# EAGLE design Current Driver v1 (EAGLE 9.6.2)
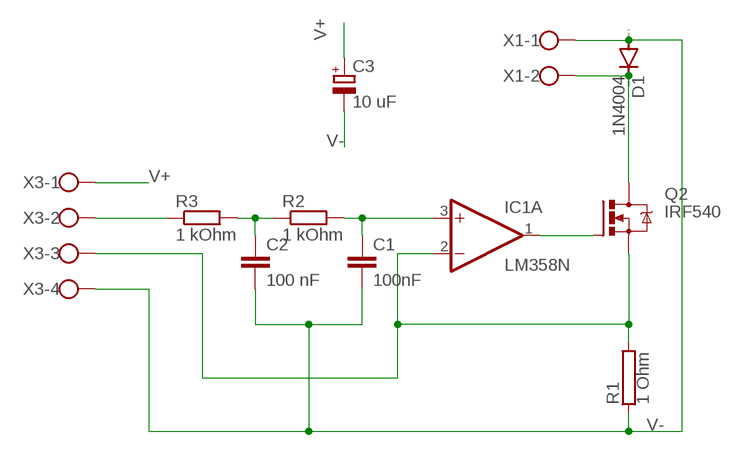
[diagram p0: schematic, sheet 1]

## Parts
C1  100nF  C-EU050-030X075  [C050-030X075]
C2  100 nF  C-EU050-030X075  [C050-030X075]
C3  10 uF  CPOL-EUE2,5-6E  [E2,5-6E]
D1  1N4004  [DO41-10]
IC1  LM358N  [DIL08]
Q2  IRF540  [TO220BV]
R1  1 Ohm  RAC05  [AC05]
R2  1 kOhm  R-EU_0204/7  [0204/7]
R3  1 kOhm  R-EU_0204/7  [0204/7]
X1  W237-102  [W237-102]
X3  W237-4  [W237-4]

## Nets
N$1: IC1.1(A:OUT) Q2.G
N$3: D1.C Q2.D X1.2
N$4: C2.1 R2.1 R3.2
N$5: C1.1 IC1.3(A:+IN) R2.2
N$6: R3.1 X3.2
N$7: IC1.2(A:-IN) Q2.S R1.2 X3.3
V+: C3.+ X3.1
V-: C1.2 C2.2 C3.- D1.A R1.1 X1.1 X3.4
Unconnected: IC1.5(B:+IN) IC1.6(B:-IN) IC1.7(B:OUT)

## Power pins joined to a net without a drawn wire
V+: IC1.8(P:V+)
V-: IC1.4(P:V-)

## Library data of the parts
C1 C2 = rcl:C-EU: CAPACITOR, European symbol; SPICEPREFIX: C
C3 = rcl:CPOL-EU: POLARIZED CAPACITOR, European symbol; SPICEPREFIX: C
D1 = diode:1N4004: DIODE general purpose rectifier, 1 A
IC1 = linear:LM358: OP AMP also LM158; LM258; LM2904 Source: http://cache.national.com/ds/LM/LM158.pdf
Q2 = transistor-power:IRF540: HEXFET Power MOSFET
R1 = resistor-power:R: Power Resitor; OC_FARNELL: unknown; OC_NEWARK: unknown
R2 R3 = rcl:R-EU_: RESISTOR, European symbol; SPICEPREFIX: R
X1 = con-wago-500:W237-102: WAGO SCREW CLAMP; MPN: 237-102; OC_FARNELL: unknown; OC_NEWARK: 70K9898
X3 = con-wago-500:W237-4: WAGO SCREW CLAMP; OC_FARNELL: unknown; OC_NEWARK: unknown

## Board
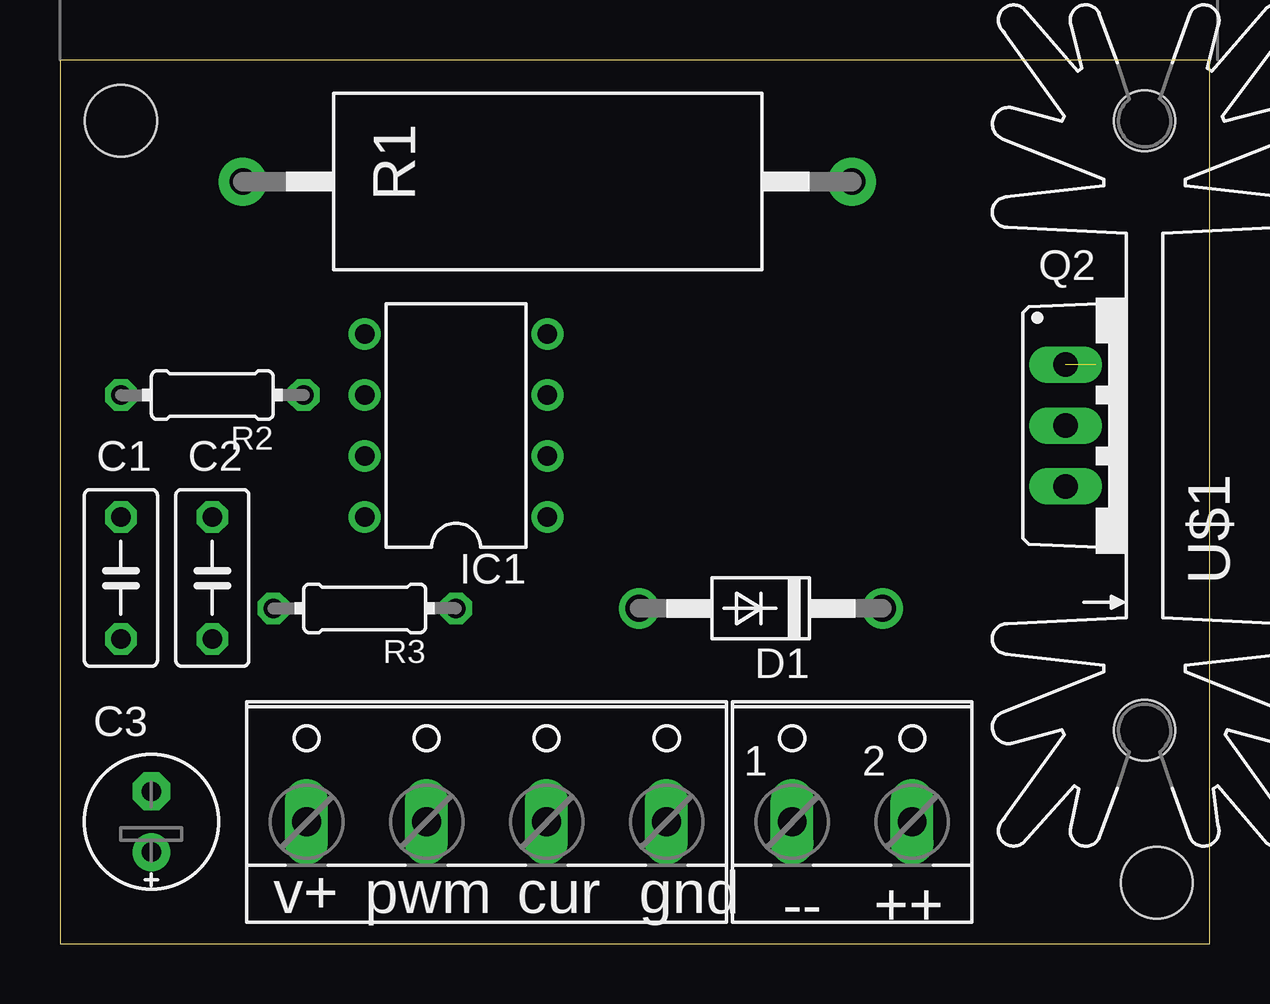
[diagram p1: board, top side]
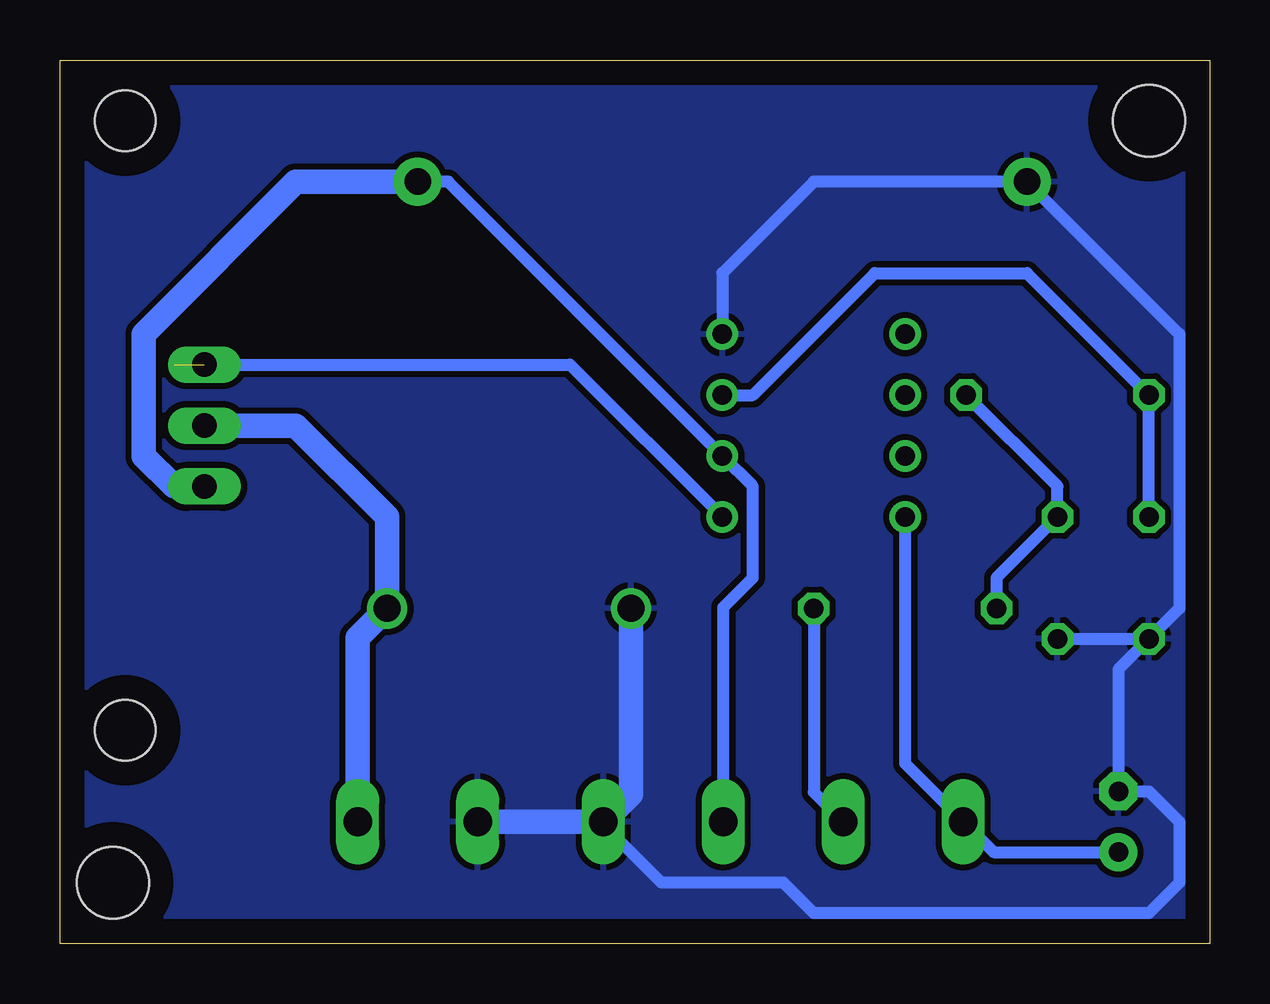
[diagram p2: board, bottom side, seen from below]

Size 47.93 x 36.82 mm. Coordinates in mm from the lower left corner, seen from the top.
Outline: 0,0 47.93,0 47.93,36.82 0,36.82 0,0
Copper layers (1*16): Top 0.035mm / dielectric 1.5mm / Bottom 0.035mm
Design rules "default *": minimum track width 10mil, minimum drill 0.35mm, track to track 10mil, track to pad 10mil, pad to pad 10mil, via to via 10mil, smd to smd 6mil, copper to edge 40mil, drill to drill 6mil, minimum pad ring 10mil, minimum via ring 8mil, stop-mask expansion 4mil, vias tented up to drill 0mil, thermal gap 10mil
Holes 3 mm at 2.54,34.29 45.72,2.54

### Footprints (pad centres in the part's own frame; a part is rotated, then mirrored left to right if it is on the bottom)
C050-030X075 = drill 0.813 octagon: 1 -2.54,0; 2 2.54,0
E2,5-6E = drill 0.813 pad 1.575: + -1.27,0 | drill 0.813 pad 1.575 octagon: - 1.27,0
DO41-10 = drill 1.118: A 5.08,0; C -5.08,0
DIL08 = drill 0.813 pad 1.27: 1 -3.81,-3.81; 2 -1.27,-3.81; 3 1.27,-3.81; 4 3.81,-3.81; 5 3.81,3.81; 6 1.27,3.81; 7 -1.27,3.81; 8 -3.81,3.81
TO220BV = drill 1.016 long: D 0,-2.54; G -2.54,-2.54; S 2.54,-2.54
AC05 = drill 1.1 pad 2: 1 -12.7,0; 2 12.7,0
0204/7 = drill 0.813 octagon: 1 -3.81,0; 2 3.81,0
SK104 = hole 2.54: -12.7,-0.762; 12.7,-0.762
W237-102 = drill 1.194 long: 1 -2.5,-1.27; 2 2.5,-1.27
W237-4 = drill 1.194 long: 1 -7.5,-1.27; 2 -2.5,-1.27; 3 2.5,-1.27; 4 7.5,-1.27

### Placement (x,y rotation side)
C1  2.54,15.24 270 top
C2  6.35,15.24 270 top
C3  3.81,5.08 90 top
D1  29.21,13.97 180 top
IC1  16.51,21.59 90 top
Q2  44.45,21.59 270 top
R1  20.32,31.75 0 top
R2  6.35,22.86 180 top
R3  12.7,13.97 180 top
U$1  [SK104]  44.45,21.59 90 top
X1  33.02,6.35 0 top
X3  17.78,6.35 0 top

### Tracks (layer width: path | path; a pad name or v marks a point on that pad's centre or on a via)
N$1  (1 unrouted)
  Bottom 0.508: IC1.1 26.67,24.13 43.18,24.13
N$3
  Bottom 1.016: X1.2 35.52,12.74 D1.C 34.29,17.78 38.1,21.59 Q2.D
N$4
  Bottom 0.508: R3.2 8.89,15.24 C2.1 6.35,19.05 R2.1
N$5
  Bottom 0.508: C1.1 R2.2 7.62,27.94 13.97,27.94 19.05,22.86 IC1.3
N$6
  Bottom 0.508: R3.1 16.51,6.31 X3.2
N$7
  Bottom 0.508: R1.2 31.75,31.75 IC1.2 19.05,19.05 19.05,15.24 20.28,14.01 X3.3
  Bottom 1.016: R1.2 38.1,31.75 44.45,25.4 44.45,20.32 43.18,19.05 Q2.S
V+
  Bottom 0.508: C3.+ 9.01,3.81 X3.1 12.7,7.5 IC1.8
V-
  Bottom 0.508: C1.2 3.81,11.43 C3.- 2.54,6.35 1.27,5.08 1.27,2.54 2.54,1.27 16.51,1.27 17.78,2.54 22.86,2.54 25.4,5.08 X3.4 | C2.2 C1.2 | IC1.4 20.32,27.94 16.51,31.75 R1.1 1.27,25.4 1.27,13.97 C1.2
  Bottom 1.016: X1.1 X3.4 24.13,6.23 D1.A
  pour Bottom: 0,36.83 48.26,36.83 48.26,0 0,0

### Text on the board
tPlace: -- | ++ | v+ | pwm | cur | gnd